# Altium project bms_mainboard-1_0.PrjPcb (part 6 of 7)

## Sheet eth_10base-t1s_phy.SchDoc
size B
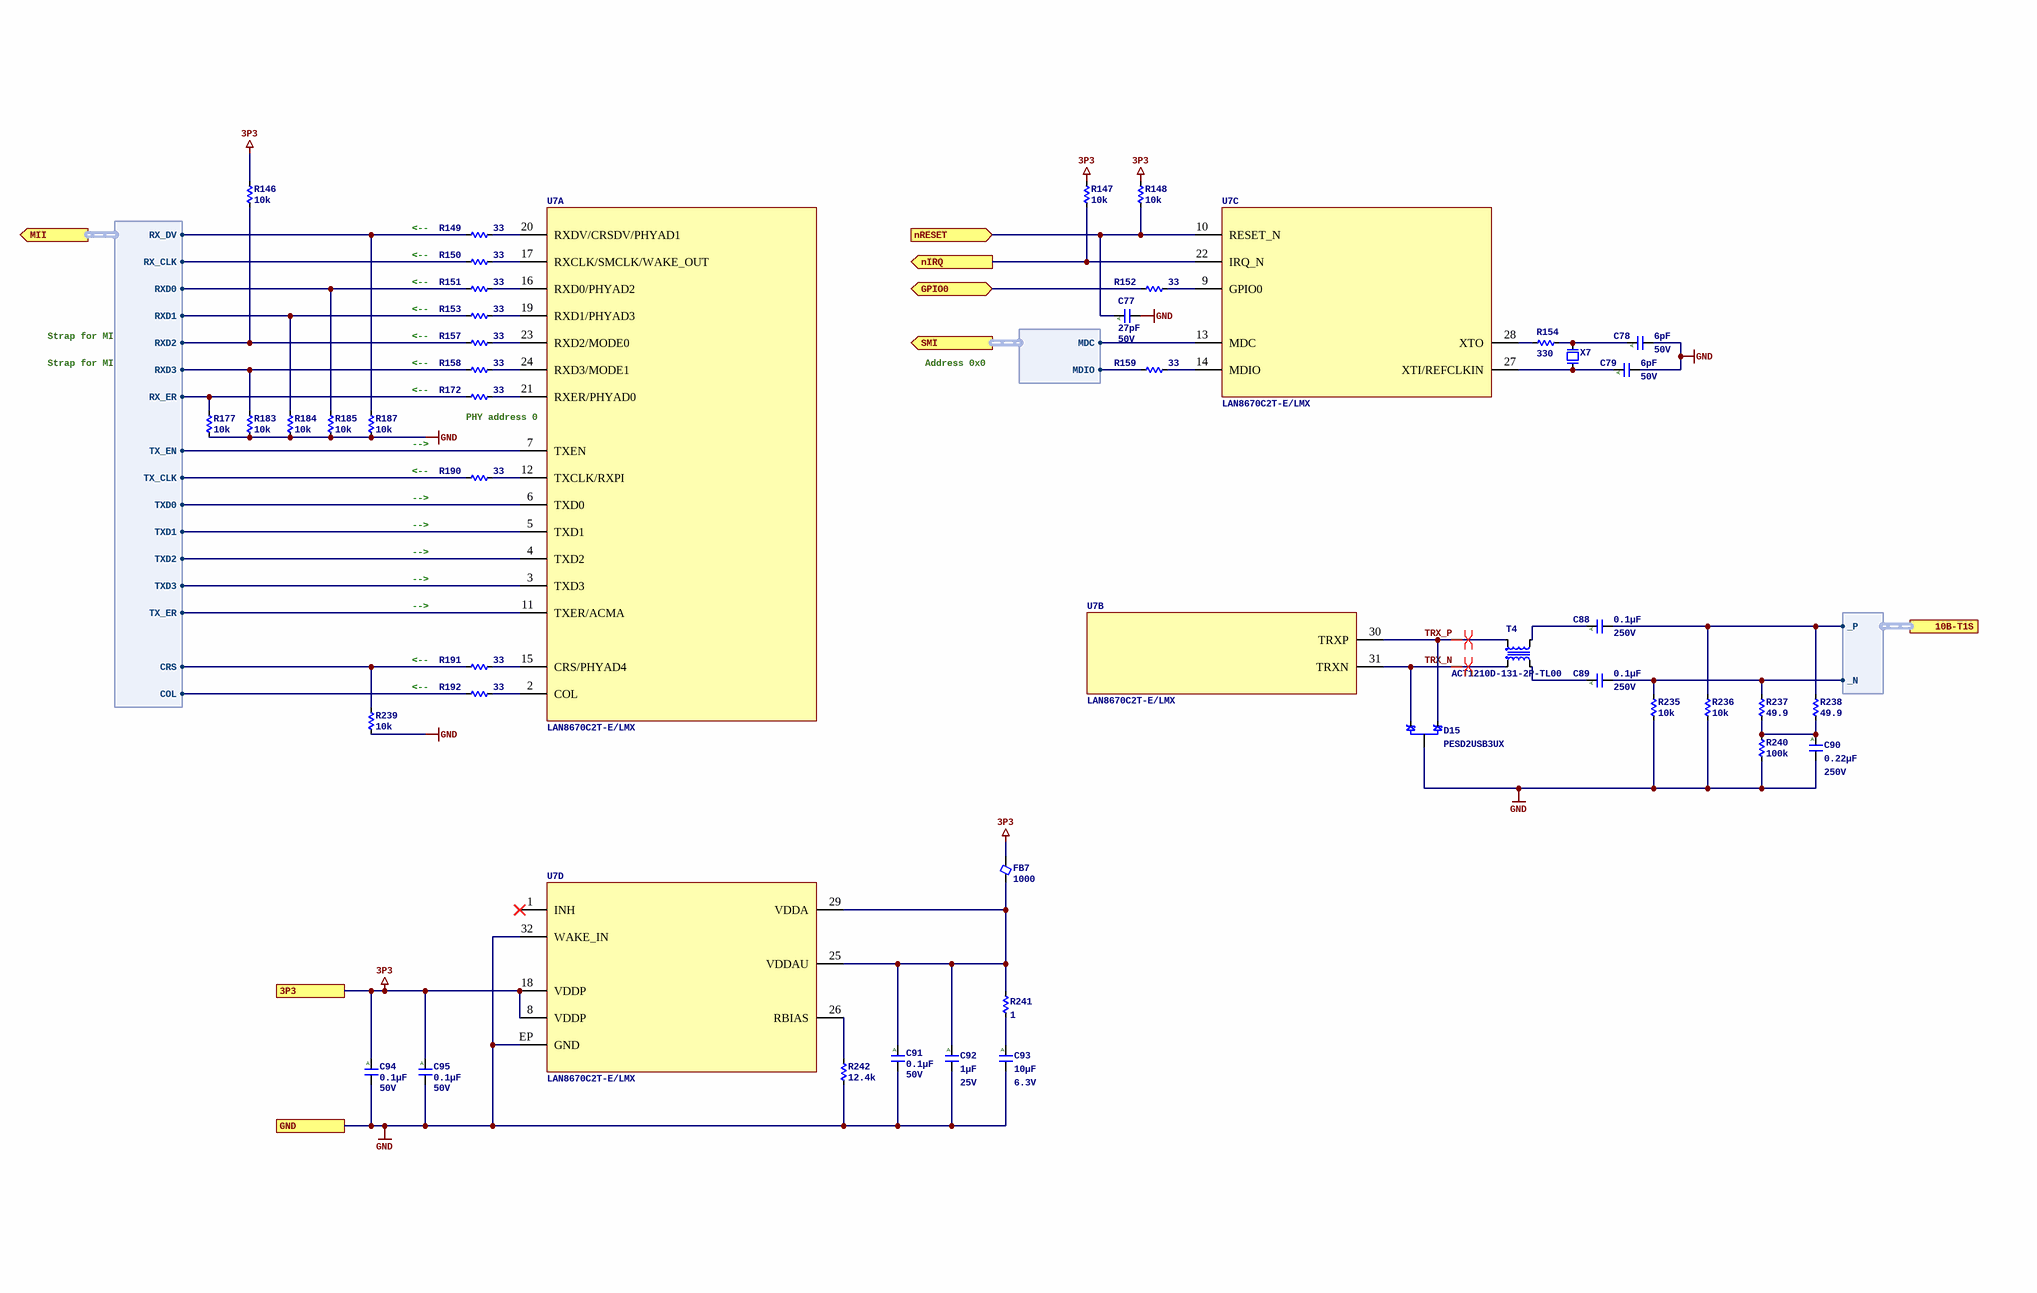
[diagram p27: eth_10base-t1s_phy.SchDoc]

### Parts
C77  Capacitance: 27pF  Voltage - Rated: 50V  [C0402_0.55MM]  (hidden comment: CGA2B2C0G1H270J050BA)
C78  Capacitance: 6pF  Voltage - Rated: 50V  [C0402_0.55MM]  (hidden comment: CGA2B2C0G1H060D050BA)
C79  Capacitance: 6pF  Voltage - Rated: 50V  [C0402_0.55MM]  (hidden comment: CGA2B2C0G1H060D050BA)
C88  Capacitance: 0.1µF  Voltage - Rated: 250V  [C1206_1.80MM]  (hidden comment: CGA5L3X7R2E104K160AA)
C89  Capacitance: 0.1µF  Voltage - Rated: 250V  [C1206_1.80MM]  (hidden comment: CGA5L3X7R2E104K160AA)
C90  Capacitance: 0.22µF  Voltage - Rated: 250V  [C1210_2.20MM]  (hidden comment: CGA6M3X7R2E224K200AA)
C91  Capacitance: 0.1µF  Voltage - Rated: 50V  [C0402_0.55MM]  (hidden comment: CGA2B3X7R1H104M050BB)
C92  Capacitance: 1µF  Voltage - Rated: 25V  [C0603_0.80MM]  (hidden comment: CGJ3E1X7R1E105K080AC)
C93  Capacitance: 10µF  Voltage - Rated: 6.3V  [C0805_1.45MM]  (hidden comment: CGA4J1X7R0J106M125AC)
C94  Capacitance: 0.1µF  Voltage - Rated: 50V  [C0402_0.55MM]  (hidden comment: CGA2B3X7R1H104M050BB)
C95  Capacitance: 0.1µF  Voltage - Rated: 50V  [C0402_0.55MM]  (hidden comment: CGA2B3X7R1H104M050BB)
D15  PESD2USB3UX  [3SOT23]
FB7  Impedance (Ohms @ 100MHz): 1000  [FB0805_1.05MM]  (hidden comment: MPZ2012S102AT000)
R146  Resistance: 10k  [R0402_0.40MM]  (hidden comment: ERJ-2RKF1002X)
R147  Resistance: 10k  [R0402_0.40MM]  (hidden comment: ERJ-2RKF1002X)
R148  Resistance: 10k  [R0402_0.40MM]  (hidden comment: ERJ-2RKF1002X)
R149  Resistance: 33  [R0402_0.40MM]  (hidden comment: ERJ-2RKF33R0X)
R150  Resistance: 33  [R0402_0.40MM]  (hidden comment: ERJ-2RKF33R0X)
R151  Resistance: 33  [R0402_0.40MM]  (hidden comment: ERJ-2RKF33R0X)
R152  Resistance: 33  [R0402_0.40MM]  (hidden comment: ERJ-2RKF33R0X)
R153  Resistance: 33  [R0402_0.40MM]  (hidden comment: ERJ-2RKF33R0X)
R154  Resistance: 330  [R0402_0.40MM]  (hidden comment: ERJ-PA2F3300X)
R157  Resistance: 33  [R0402_0.40MM]  (hidden comment: ERJ-2RKF33R0X)
R158  Resistance: 33  [R0402_0.40MM]  (hidden comment: ERJ-2RKF33R0X)
R159  Resistance: 33  [R0402_0.40MM]  (hidden comment: ERJ-2RKF33R0X)
R172  Resistance: 33  [R0402_0.40MM]  (hidden comment: ERJ-2RKF33R0X)
R177  Resistance: 10k  [R0402_0.40MM]  (hidden comment: ERJ-2RKF1002X)
R183  Resistance: 10k  [R0402_0.40MM]  (hidden comment: ERJ-2RKF1002X)
R184  Resistance: 10k  [R0402_0.40MM]  (hidden comment: ERJ-2RKF1002X)
R185  Resistance: 10k  [R0402_0.40MM]  (hidden comment: ERJ-2RKF1002X)
R187  Resistance: 10k  [R0402_0.40MM]  (hidden comment: ERJ-2RKF1002X)
R190  Resistance: 33  [R0402_0.40MM]  (hidden comment: ERJ-2RKF33R0X)
R191  Resistance: 33  [R0402_0.40MM]  (hidden comment: ERJ-2RKF33R0X)
R192  Resistance: 33  [R0402_0.40MM]  (hidden comment: ERJ-2RKF33R0X)
R235  Resistance: 10k  [R1206_0.70MM]  (hidden comment: ERJ-8ENF1002V)
R236  Resistance: 10k  [R1206_0.70MM]  (hidden comment: ERJ-8ENF1002V)
R237  Resistance: 49.9  [R1206_0.70MM]  (hidden comment: ERJ-8ENF49R9V)
R238  Resistance: 49.9  [R1206_0.70MM]  (hidden comment: ERJ-8ENF49R9V)
R239  Resistance: 10k  [R0402_0.40MM]  (hidden comment: ERJ-2RKF1002X)
R240  Resistance: 100k  [R1206_0.70MM]  (hidden comment: ERJ-8ENF1003V)
R241  Resistance: 1  [R0402_0.40MM]  (hidden comment: ERJ-2BQF1R0X)
R242  Resistance: 12.4k  [R0402_0.40MM]  (hidden comment: ERJ-2RKF1242X)
T4  ACT1210D-131-2P-TL00  [CHOKE_ACT1210D-131-2P-TL00]
U7  LAN8670C2T-E/LMX  [QFN50P500X500X90-32N]  (parts A,B,C,D of 4)
X7  XTAL_XRCGB25M000F3A00R0  [4_SMD_2.0X1.6MM]  (value not drawn)

### Ports
3P3, 10B-T1S (harness DIFF), GND, GPIO0 (bidir), MII (out, harness MII), nIRQ (out), nRESET (in), SMI (out, harness SMI)

### Harnesses
MII: RXD0, RXD1, TX_EN, TXD0, TXD1, RXD2, RXD3, TXD2, TXD3, TX_ER, TX_CLK, CRS, COL, RX_ER, RX_DV, RX_CLK
SMI: MDC, MDIO
DIFF: _N, _P

### Nets
3P3: C94.1 C95.1 FB7.2 R146.1 R147.1 R148.1 U7.8(VDDP) U7.18(VDDP) ; port 3P3
GND: C77.2 C78.2 C79.2 C90.2 C91.2 C92.2 C93.2 C94.2 C95.2 D15.3 R177.2 R183.2 R184.2 R185.2 R187.2 R235.2 R236.2 R239.2 R240.2 R242.2 U7.32(WAKE_IN) U7.EP(GND) ; port GND
10B-T1S_MDI._N: C89.2 R235.1 R237.1 ; port 10B-T1S._N
10B-T1S_MDI._P: C88.2 R236.1 R238.1 ; port 10B-T1S._P
MII_P7.COL: R192.2 ; port MII.COL
MII_P7.CRS: R191.2 R239.1 ; port MII.CRS
MII_P7.RX_CLK: R150.2 ; port MII.RX_CLK
MII_P7.RX_DV: R149.2 R187.1 ; port MII.RX_DV
MII_P7.RX_ER: R172.2 R177.1 ; port MII.RX_ER
MII_P7.RXD0: R151.2 R185.1 ; port MII.RXD0
MII_P7.RXD1: R153.2 R184.1 ; port MII.RXD1
MII_P7.RXD2: R146.2 R157.2 ; port MII.RXD2
MII_P7.RXD3: R158.2 R183.1 ; port MII.RXD3
MII_P7.TX_CLK: R190.2 ; port MII.TX_CLK
MII_P7.TX_EN: U7.7(TXEN) ; port MII.TX_EN
MII_P7.TX_ER: U7.11(TXER/ACMA) ; port MII.TX_ER
MII_P7.TXD0: U7.6(TXD0) ; port MII.TXD0
MII_P7.TXD1: U7.5(TXD1) ; port MII.TXD1
MII_P7.TXD2: U7.4(TXD2) ; port MII.TXD2
MII_P7.TXD3: U7.3(TXD3) ; port MII.TXD3
PHY_GPIO0: R152.2 ; port GPIO0
PHY_nIRQ: R147.2 U7.22(IRQ_N) ; port nIRQ
PHY_nRESET: C77.1 R148.2 U7.10(RESET_N) ; port nRESET
SMI.MDC: U7.13(MDC) ; port SMI.MDC
SMI.MDIO: R159.2 ; port SMI.MDIO
TRX_N: D15.1 T4.2 U7.31(TRXN)
TRX_P: D15.2 T4.1 U7.30(TRXP)
NetC78_1: C78.1 R154.2 X7.3
NetC79_1: C79.1 U7.27(XTI/REFCLKIN) X7.1
NetC88_1: C88.1 T4.4
NetC89_1: C89.1 T4.3
NetC90_1: C90.1 R237.2 R238.2 R240.1
NetC91_1: C91.1 C92.1 FB7.1 R241.2 U7.25(VDDAU) U7.29(VDDA)
NetC93_1: C93.1 R241.1
NetR149_1: R149.1 U7.20(RXDV/CRSDV/PHYAD1)
NetR150_1: R150.1 U7.17(RXCLK/SMCLK/WAKE_OUT)
NetR151_1: R151.1 U7.16(RXD0/PHYAD2)
NetR152_1: R152.1 U7.9(GPIO0)
NetR153_1: R153.1 U7.19(RXD1/PHYAD3)
NetR154_1: R154.1 U7.28(XTO)
NetR157_1: R157.1 U7.23(RXD2/MODE0)
NetR158_1: R158.1 U7.24(RXD3/MODE1)
NetR159_1: R159.1 U7.14(MDIO)
NetR172_1: R172.1 U7.21(RXER/PHYAD0)
NetR190_1: R190.1 U7.12(TXCLK/RXPI)
NetR191_1: R191.1 U7.15(CRS/PHYAD4)
NetR192_1: R192.1 U7.2(COL)
NetR242_1: R242.1 U7.26(RBIAS)

Not connected (* = marked no-connect by the designer): U7 1(INH)*

### Layout directives
differential pair; differential pair class DE_100: TRX_N, TRX_P

### Notes on the sheet
- <--
- Strap for MII
- Address 0x0
- (near R187) <--
- PHY address 0
- -->
- (near R187) -->
- (near R239) <--
- (in symbol CGA2B2C0G1H060D050BA) A
- (in symbol CGA2B2C0G1H270J050BA) A
- (in symbol CGA2B3X7R1H104M050BB) A
- (in symbol CGA4J1X7R0J106M125AC) A
- (in symbol CGA5L3X7R2E104K160AA) A
- (in symbol CGA6M3X7R2E224K200AA) A
- (in symbol CGJ3E1X7R1E105K080AC) A

### Library data of the parts
C77 = CGA2B2C0G1H270J050BA: CAP CER 27PF 50V C0G 0402; Manufacturer: TDK Corporation; Unit Price (USD): 0.1; Tolerance: ±5%; Temperature Coefficient: C0G, NP0; ComponentLink1URL: https://product.tdk.com/info/en/catalog/datasheets/mlcc_automotive_general_en.pdf?ref_disty=digikey; ComponentLink1Description: Series Datasheet; Series: CGA; Part Status: Active; Operating Temperature: -55°C ~ 125°C; Applications: AEC-Q200; Mounting Type: Surface Mount, MLCC; Package / Case: 0402 (1005 Metric); Size / Dimension: 0.039" L x 0.020" W (1.00mm x 0.50mm); Thickness (Max): 0.022" (0.55mm); Supplier 1: Digikey; Supplier Part Number 1: 445-5589-1-ND; Manufacturer Part Number: CGA2B2C0G1H270J050BA
C78 C79 = CGA2B2C0G1H060D050BA: CAP CER 6PF 50V C0G 0402; Manufacturer: TDK Corporation; Unit Price (USD): 0.1; Tolerance: ±0.5pF; Temperature Coefficient: C0G, NP0; ComponentLink1URL: https://product.tdk.com/info/en/catalog/datasheets/mlcc_automotive_general_en.pdf?ref_disty=digikey; ComponentLink1Description: Series Datasheet; Supplier 1: Digikey; Supplier Part Number 1: 445-5579-1-ND; Series: CGA; Part Status: Active; Operating Temperature: -55°C ~ 125°C; Applications: AEC-Q200; Mounting Type: Surface Mount, MLCC; Package / Case: 0402 (1005 Metric); Size / Dimension: 0.039" L x 0.020" W (1.00mm x 0.50mm); Thickness (Max): 0.022" (0.55mm); Manufacturer Part Number: CGA2B2C0G1H060D050BA
C88 C89 = CGA5L3X7R2E104K160AA: CAP CER 0.1UF 250V X7R 1206; Manufacturer: TDK Corporation; Unit Price (USD): 0.43; Tolerance: ±10%; ComponentLink1URL: https://product.tdk.com/info/en/catalog/datasheets/mlcc_automotive_midvoltage_en.pdf?ref_disty=digikey; ComponentLink1Description: Series Datasheet; Supplier 1: Digikey; Supplier Part Number 1: 445-5851-1-ND; Series: CGA; Part Status: Active; Temperature Coefficient: X7R; Operating Temperature: -55°C ~ 125°C; Applications: AEC-Q200; Mounting Type: Surface Mount, MLCC; Package / Case: 1206 (3216 Metric); Size / Dimension: 0.126" L x 0.063" W (3.20mm x 1.60mm); Thickness (Max): 0.071" (1.80mm); Manufacturer Part Number: CGA5L3X7R2E104K160AA
C90 = CGA6M3X7R2E224K200AA: CAP CER 0.22UF 250V X7R 1210; Manufacturer: TDK Corporation; Unit Price (USD): 0.77; Tolerance: ±10%; ComponentLink1URL: https://product.tdk.com/info/en/catalog/datasheets/mlcc_automotive_midvoltage_en.pdf?ref_disty=digikey; ComponentLink1Description: Series Datasheet; Supplier 1: Digikey; Supplier Part Number 1: 445-5869-1-ND; Series: CGA; Part Status: Active; Temperature Coefficient: X7R; Operating Temperature: -55°C ~ 125°C; Applications: AEC-Q200; Mounting Type: Surface Mount, MLCC; Package / Case: 1210 (3225 Metric); Size / Dimension: 0.126" L x 0.098" W (3.20mm x 2.50mm); Thickness (Max): 0.087" (2.20mm); Manufacturer Part Number: CGA6M3X7R2E224K200AA
C91 C94 C95 = CGA2B3X7R1H104M050BB: CAP CER 0.1UF 50V X7R 0402; Manufacturer: TDK Corporation; Unit Price (USD): 0.17; Tolerance: ±20%; ComponentLink1URL: https://product.tdk.com/info/en/catalog/datasheets/mlcc_automotive_general_en.pdf?ref_disty=digikey; ComponentLink1Description: Series Datasheet; Series: CGA; Part Status: Active; Temperature Coefficient: X7R; Operating Temperature: -55°C ~ 125°C; Applications: AEC-Q200; Mounting Type: Surface Mount, MLCC; Package / Case: 0402 (1005 Metric); Size / Dimension: 0.039" L x 0.020" W (1.00mm x 0.50mm); Thickness (Max): 0.022" (0.55mm); Supplier 1: Digikey; Supplier Part Number 1: 445-12271-1-ND; Manufacturer Part Number: CGA2B3X7R1H104M050BB
C92 = CGJ3E1X7R1E105K080AC: CAP CER 1UF 25V X7R 0603; Manufacturer: TDK Corporation; Unit Price (USD): 0.55; Tolerance: ±10%; ComponentLink1URL: https://product.tdk.com/info/en/catalog/datasheets/mlcc_highreliability_general_en.pdf?ref_disty=digikey; ComponentLink1Description: Series Datasheet; Series: CGJ; Part Status: Active; Temperature Coefficient: X7R; Operating Temperature: -55°C ~ 125°C; Applications: AEC-Q200; Mounting Type: Surface Mount, MLCC; Package / Case: 0603 (1608 Metric); Size / Dimension: 0.063" L x 0.031" W (1.60mm x 0.80mm); Thickness (Max): 0.031" (0.80mm); Supplier 1: Digikey; Supplier Part Number 1: 445-13311-1-ND; Manufacturer Part Number: CGJ3E1X7R1E105K080AC
C93 = CGA4J1X7R0J106M125AC: CAP CER 10UF 6.3V X7R 0805; Manufacturer: TDK Corporation; Unit Price (USD): 0.43; Tolerance: ±20%; ComponentLink1URL: https://product.tdk.com/info/en/catalog/datasheets/mlcc_automotive_general_en.pdf?ref_disty=digikey; ComponentLink1Description: Series Datasheet; Series: CGA; Part Status: Active; Temperature Coefficient: X7R; Operating Temperature: -55°C ~ 125°C; Applications: AEC-Q200; Mounting Type: Surface Mount, MLCC; Package / Case: 0805 (2012 Metric); Size / Dimension: 0.079" L x 0.049" W (2.00mm x 1.25mm); Thickness (Max): 0.057" (1.45mm); Supplier 1: Digikey; Supplier Part Number 1: 445-12776-1-ND; Manufacturer Part Number: CGA4J1X7R0J106M125AC
D15 = TVS_PESD2USB3UX-T: DIODE ESD USB SOT-23; Manufacturer: Nexperia USA Inc.; Supplier 1: Digikey; Supplier Part Number 1: 1727-PESD2USB3UX-CT-ND; Manufacturer Part Number: PESD2USB3UX; Supplier 2: LCSC; Supplier Part Number 2: C3708426; ComponentLink1Description: Datasheet; ComponentLink1URL: https://assets.nexperia.com/documents/data-sheet/PESD2USB3UX-T.pdf
FB7 = MPZ2012S102AT000: FERRITE BEAD 1 KOHM 0805 1LN; Manufacturer: TDK Corporation; Filter Type: Power Line; Current Rating (Max): 1.5A; DC Resistance (DCR) (Max): 150mOhm; ComponentLink1URL: https://product.tdk.com/info/en/catalog/datasheets/beads_commercial_power_mpz2012_en.pdf; ComponentLink1Description: Datasheet; Series: MPZ; Part Status: Active; Operating Temperature: -55°C ~ 125°C; Package / Case: 0805 (2012 Metric); Mounting Type: Surface Mount; Height (Max): 0.041" (1.05mm); Size / Dimension: 0.079" L x 0.049" W (2.00mm x 1.25mm); Supplier Part Number 1: 445-5223-1-ND; Supplier 1: Digikey; Manufacturer Part Number: MPZ2012S102AT000; Supplier 2: LCSC; Supplier Part Number 2: C76817
R146-R148 R177 R183-R185 R187 R239 = ERJ-2RKF1002X: as R264 on sheet digital_input_protection; ComponentLink1Description: Datasheet; ComponentLink1URL: https://industrial.panasonic.com/cdbs/www-data/pdf/RDA0000/AOA0000C304.pdf; Series: ERJ; Tolerance: ±1%; Composition: Thick Film; Features: Automotive AEC-Q200; Operating Temperature: -55°C ~ 155°C; Package / Case: 0402 (1005 Metric); Supplier Device Package: 0402; Size / Dimension: 0.039" L x 0.020" W (1.00mm x 0.50mm); Height - Seated (Max): 0.016" (0.40mm); Supplier 1: Digikey; Supplier Part Number 1: P10.0KLCT-ND; Manufacturer Part Number: ERJ-2RKF1002X
R149-R153 R157-R159 R172 R190-R192 = ERJ-2RKF33R0X: RES SMD 33 OHM 1% 1/10W 0402; Manufacturer: Panasonic Electronic Components; Unit Price (USD): 0.1; Power (Watts): 0.1W, 1/10W; Temperature Coefficient: ±100ppm/°C; ComponentLink1Description: Datasheet; ComponentLink1URL: https://industrial.panasonic.com/cdbs/www-data/pdf/RDA0000/AOA0000C304.pdf; Series: ERJ; Tolerance: ±1%; Composition: Thick Film; Features: Automotive AEC-Q200; Operating Temperature: -55°C ~ 155°C; Package / Case: 0402 (1005 Metric); Supplier Device Package: 0402; Size / Dimension: 0.039" L x 0.020" W (1.00mm x 0.50mm); Height - Seated (Max): 0.016" (0.40mm); Supplier 1: Digikey; Supplier Part Number 1: P33.0LCT-ND; Manufacturer Part Number: ERJ-2RKF33R0X
R154 = ERJ-PA2F3300X: RES SMD 330 OHM 1% 1/5W 0402; Manufacturer: Panasonic Electronic Components; Unit Price (USD): 0.21; Power (Watts): 0.2W, 1/5W; Temperature Coefficient: ±100ppm/°C; ComponentLink1Description: Datasheet; ComponentLink1URL: https://industrial.panasonic.com/cdbs/www-data/pdf/RDO0000/AOA0000C331.pdf; Series: ERJ; Tolerance: ±1%; Composition: Thick Film; Features: Automotive AEC-Q200, Pulse Withstanding; Operating Temperature: -55°C ~ 155°C; Package / Case: 0402 (1005 Metric); Supplier Device Package: 0402; Size / Dimension: 0.039" L x 0.020" W (1.00mm x 0.50mm); Height - Seated (Max): 0.016" (0.40mm); Supplier 1: Digikey; Supplier Part Number 1: P17221CT-ND; Manufacturer Part Number: ERJ-PA2F3300X
R235 R236 = ERJ-8ENF1002V: RES SMD 10K OHM 1% 1/4W 1206; Manufacturer: Panasonic Electronic Components; Unit Price (USD): 0.1; Power (Watts): 0.25W, 1/4W; Temperature Coefficient: ±100ppm/°C; ComponentLink1Description: Datasheet; ComponentLink1URL: https://industrial.panasonic.com/cdbs/www-data/pdf/RDA0000/AOA0000C304.pdf; Series: ERJ; Tolerance: ±1%; Composition: Thick Film; Features: Automotive AEC-Q200; Operating Temperature: -55°C ~ 155°C; Package / Case: 1206 (3216 Metric); Supplier Device Package: 1206; Size / Dimension: 0.126" L x 0.063" W (3.20mm x 1.60mm); Height - Seated (Max): 0.028" (0.70mm); Supplier 1: Digikey; Supplier Part Number 1: P10.0KFCT-ND; Manufacturer Part Number: ERJ-8ENF1002V
R237 R238 = ERJ-8ENF49R9V: RES SMD 49.9 OHM 1% 1/4W 1206; Manufacturer: Panasonic Electronic Components; Unit Price (USD): 0.1; Power (Watts): 0.25W, 1/4W; Temperature Coefficient: ±100ppm/°C; ComponentLink1Description: Datasheet; ComponentLink1URL: https://industrial.panasonic.com/cdbs/www-data/pdf/RDA0000/AOA0000C304.pdf; Series: ERJ; Tolerance: ±1%; Composition: Thick Film; Features: Automotive AEC-Q200; Operating Temperature: -55°C ~ 155°C; Package / Case: 1206 (3216 Metric); Supplier Device Package: 1206; Size / Dimension: 0.126" L x 0.063" W (3.20mm x 1.60mm); Height - Seated (Max): 0.028" (0.70mm); Supplier 1: Digikey; Supplier Part Number 1: P49.9FCT-ND; Manufacturer Part Number: ERJ-8ENF49R9V
R240 = ERJ-8ENF1003V: RES SMD 100K OHM 1% 1/4W 1206; Manufacturer: Panasonic Electronic Components; Unit Price (USD): 0.1; Power (Watts): 0.25W, 1/4W; Temperature Coefficient: ±100ppm/°C; ComponentLink1Description: Datasheet; ComponentLink1URL: https://industrial.panasonic.com/cdbs/www-data/pdf/RDA0000/AOA0000C304.pdf; Series: ERJ; Tolerance: ±1%; Composition: Thick Film; Features: Automotive AEC-Q200; Operating Temperature: -55°C ~ 155°C; Package / Case: 1206 (3216 Metric); Supplier Device Package: 1206; Size / Dimension: 0.126" L x 0.063" W (3.20mm x 1.60mm); Height - Seated (Max): 0.028" (0.70mm); Supplier 1: Digikey; Supplier Part Number 1: P100KFCT-ND; Manufacturer Part Number: ERJ-8ENF1003V
R241 = ERJ-2BQF1R0X: RES SMD 1 OHM 1% 1/6W 0402; Manufacturer: Panasonic Electronic Components; Unit Price (USD): 0.41; Power (Watts): 0.167W, 1/6W; Temperature Coefficient: ±250ppm/°C; ComponentLink1Description: Datasheet; ComponentLink1URL: https://industrial.panasonic.com/cdbs/www-data/pdf/RDN0000/AOA0000C313.pdf; Series: ERJ; Tolerance: ±1%; Composition: Thick Film; Features: Automotive AEC-Q200, Current Sense; Operating Temperature: -55°C ~ 125°C; Package / Case: 0402 (1005 Metric); Supplier Device Package: 0402; Size / Dimension: 0.039" L x 0.020" W (1.00mm x 0.50mm); Height - Seated (Max): 0.016" (0.40mm); Supplier 1: Digikey; Supplier Part Number 1: P17252CT-ND; Manufacturer Part Number: ERJ-2BQF1R0X
R242 = ERJ-2RKF1242X: RES SMD 12.4K OHM 1% 1/10W 0402; Manufacturer: Panasonic Electronic Components; Unit Price (USD): 0.1; Power (Watts): 0.1W, 1/10W; Temperature Coefficient: ±100ppm/°C; ComponentLink1Description: Datasheet; ComponentLink1URL: https://industrial.panasonic.com/cdbs/www-data/pdf/RDA0000/AOA0000C304.pdf; Series: ERJ; Tolerance: ±1%; Composition: Thick Film; Features: Automotive AEC-Q200; Operating Temperature: -55°C ~ 155°C; Package / Case: 0402 (1005 Metric); Supplier Device Package: 0402; Size / Dimension: 0.039" L x 0.020" W (1.00mm x 0.50mm); Height - Seated (Max): 0.016" (0.40mm); Supplier 1: Digikey; Supplier Part Number 1: P12.4KLCT-ND; Manufacturer Part Number: ERJ-2RKF1242X
T4 = CHOKE_ACT1210D-131-2P-TL00: 130 µH @ 100 kHz 2 Line Common Mode Choke Surface Mount 6.7 kOhms @ 10 MHz 115mA DCR 3.5Ohm; Manufacturer: TDK Corporation; Supplier 1: Digikey; ComponentLink1URL: https://product.tdk.com/system/files/dam/doc/product/emc/emc/cmf_cmc/catalog/cmf_automotive_signal_act1210d_en.pdf; ComponentLink1Description: Datasheet; Supplier Part Number 1: 445-ACT1210D-131-2P-TL00CT-ND; Manufacturer Part Number: ACT1210D-131-2P-TL00; Supplier 2: LCSC; Supplier Part Number 2: C5547342
U7 = ETH_PHY_LAN8670C2T-E/LMX: 10BASE-T1S PHY WITH MII/RMII "1/1 Transceiver Full, Half Ethernet 32-VQFN (5x5)"; Manufacturer: Microchip; Supplier 1: DigiKey; Supplier Part Number 1: 150-LAN8670C2T-E/LMXCT-ND; Manufacturer Part Number: LAN8670C2T-E/LMX; ComponentLink1Description: Datasheet; ComponentLink1URL: https://ww1.microchip.com/downloads/aemDocuments/documents/AIS/ProductDocuments/DataSheets/LAN8670-1-2-Data-Sheet-60001573.pdf; Supplier 2: LCSC; Supplier Part Number 2: C20901523
X7 = XTAL_XRCGB25M000F3A00R0: as X4 on sheet eth_ksz8567r_switch; Supplier 1: Digikey; Supplier Part Number 1: 490-12146-2-ND; Manufacturer Part Number: XRCGB25M000F3A00R0; Supplier 2: LCSC; Supplier Part Number 2: C467842; ComponentLink1Description: Datasheet; ComponentLink1URL: https://www.murata.com/products/productdata/8801076543518/SPEC-XRCGB25M000F3A00R0.pdf

## Sheet isolator_si8662.SchDoc
size A
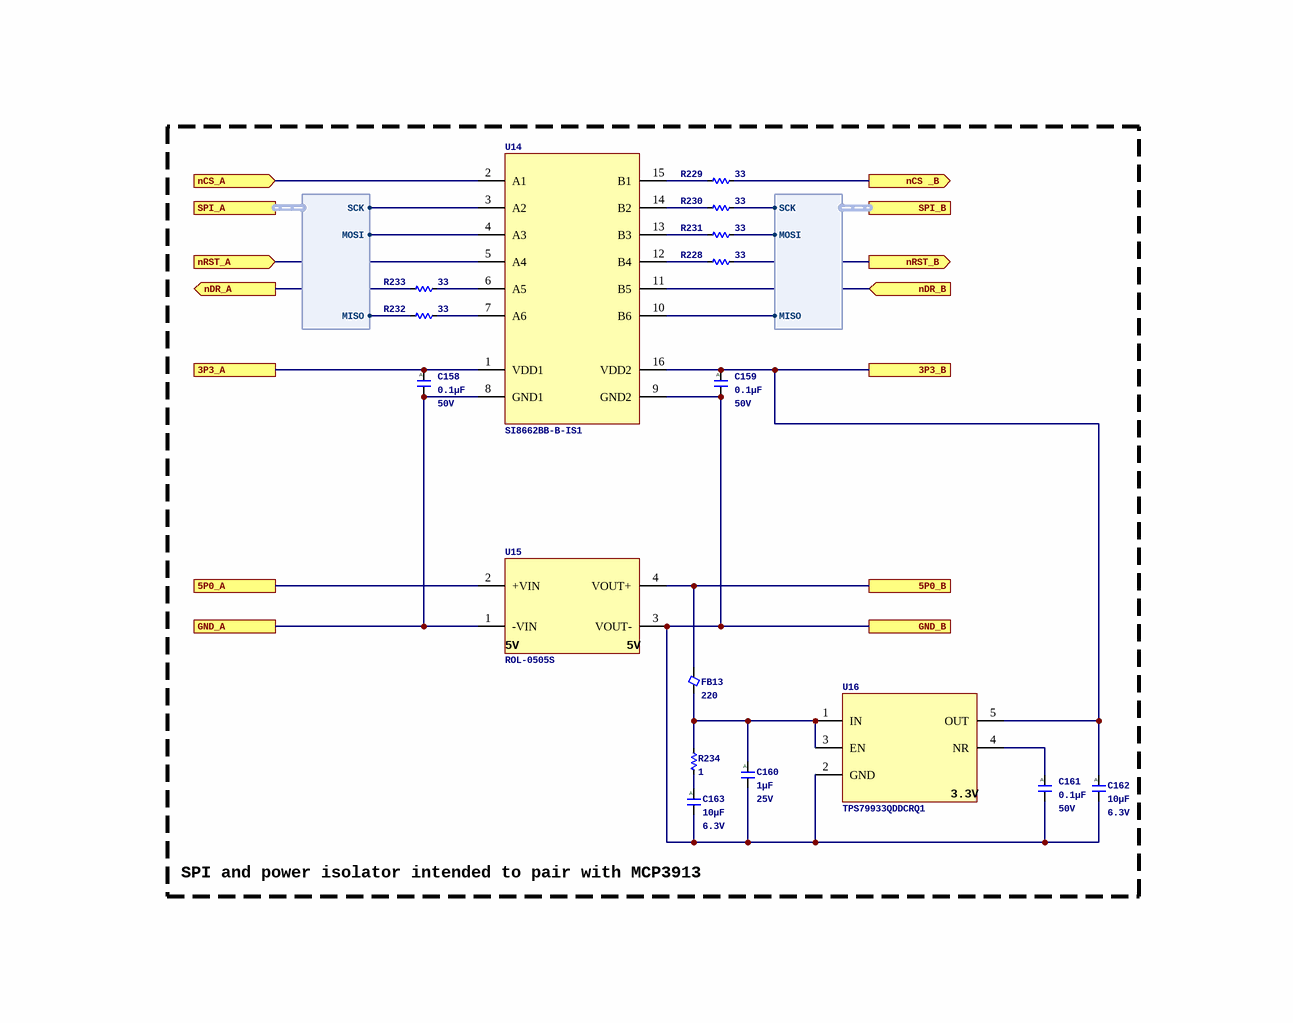
[diagram p28: isolator_si8662.SchDoc]

### Parts
C158  Capacitance: 0.1µF  Voltage - Rated: 50V  [C0402_0.55MM]  (hidden comment: CGA2B3X7R1H104M050BB)
C159  Capacitance: 0.1µF  Voltage - Rated: 50V  [C0402_0.55MM]  (hidden comment: CGA2B3X7R1H104M050BB)
C160  Capacitance: 1µF  Voltage - Rated: 25V  [C0603_0.80MM]  (hidden comment: CGJ3E1X7R1E105K080AC)
C161  Capacitance: 0.1µF  Voltage - Rated: 50V  [C0402_0.55MM]  (hidden comment: CGA2B3X7R1H104M050BB)
C162  Capacitance: 10µF  Voltage - Rated: 6.3V  [C0805_1.45MM]  (hidden comment: CGA4J1X7R0J106M125AC)
C163  Capacitance: 10µF  Voltage - Rated: 6.3V  [C0805_1.45MM]  (hidden comment: CGA4J1X7R0J106M125AC)
FB13  Impedance (Ohms @ 100MHz): 220  [FB0402_0.55MM]  (hidden comment: MPZ1005S221ET000)
R228  Resistance: 33  [R0402_0.40MM]  (hidden comment: ERJ-2RKF33R0X)
R229  Resistance: 33  [R0402_0.40MM]  (hidden comment: ERJ-2RKF33R0X)
R230  Resistance: 33  [R0402_0.40MM]  (hidden comment: ERJ-2RKF33R0X)
R231  Resistance: 33  [R0402_0.40MM]  (hidden comment: ERJ-2RKF33R0X)
R232  Resistance: 33  [R0402_0.40MM]  (hidden comment: ERJ-2RKF33R0X)
R233  Resistance: 33  [R0402_0.40MM]  (hidden comment: ERJ-2RKF33R0X)
R234  Resistance: 1  [R0402_0.40MM]  (hidden comment: ERJ-2BQF1R0X)
U14  SI8662BB-B-IS1  [16SOIC150]
U15  ROL-0505S  [4SIP]
U16  TPS79933QDDCRQ1  [5SOT23]

### Blocks framed on the sheet
SPI and power isolator intended to pair with MCP3913: C158-C163 FB13 R228-R234 U14-U16

### Ports
3P3_A, 3P3_B, 5P0_A, 5P0_B, GND_A, GND_B, nCS _B (out), nCS_A (in), nDR_A (out), nDR_B (in), nRST_A (in), nRST_B (out), SPI_A (harness SPI), SPI_B (harness SPI)

### Harnesses
SPI: MISO, MOSI, SCK

### Nets
3P3: C158.1 U14.1(VDD1) ; port 3P3_A
3P3_B: C159.1 C162.1 U14.16(VDD2) U16.5(OUT) ; port 3P3_B
5P0: U15.2(+VIN) ; port 5P0_A
5P0_B: FB13.2 U15.4(VOUT+) ; port 5P0_B
GND: C158.2 U14.8(GND1) U15.1(-VIN) ; port GND_A
HV_N: C159.2 C160.2 C161.2 C162.2 C163.2 U14.9(GND2) U15.3(VOUT-) U16.2(GND) ; port GND_B
MCP3913_nDR: R233.2 ; port nDR_A
MCP3913_nDR_ISO: U14.11(B5) ; port nDR_B
MCP3913_nRST: U14.5(A4) ; port nRST_A
MCP3913_nRST_ISO: R228.1 ; port nRST_B
SPI4.MISO: R232.2 ; port SPI_A.MISO
SPI4.MOSI: U14.4(A3) ; port SPI_A.MOSI
SPI4.SCK: U14.3(A2) ; port SPI_A.SCK
SPI4_ISO.MISO: U14.10(B6) ; port SPI_B.MISO
SPI4_ISO.MOSI: R231.1 ; port SPI_B.MOSI
SPI4_ISO.SCK: R230.1 ; port SPI_B.SCK
SPI4_nSS: U14.2(A1) ; port nCS_A
SPI4_nSS_ISO: R229.1 ; port nCS _B
NetC160_1: C160.1 FB13.1 R234.2 U16.1(IN) U16.3(EN)
NetC161_1: C161.1 U16.4(NR)
NetC163_1: C163.1 R234.1
NetR228_2: R228.2 U14.12(B4)
NetR229_2: R229.2 U14.15(B1)
NetR230_2: R230.2 U14.14(B2)
NetR231_2: R231.2 U14.13(B3)
NetR232_1: R232.1 U14.7(A6)
NetR233_1: R233.1 U14.6(A5)

### Notes on the sheet
- (in symbol CGA2B3X7R1H104M050BB) A
- (in symbol CGA4J1X7R0J106M125AC) A
- (in symbol CGJ3E1X7R1E105K080AC) A
- (in symbol CONV_DCDC_5V_0.5W_ROL-0505S) 5V
- (in symbol LDO_TPS79933QDDCRQ1) 3.3V
- (in symbol ROL-0505S) 5V
- (in symbol TPS79933QDDCRQ1) 3.3V

### Library data of the parts
C158 C159 C161 = CGA2B3X7R1H104M050BB: as C91 on sheet eth_10base-t1s_phy; ComponentLink1URL: https://product.tdk.com/info/en/catalog/datasheets/mlcc_automotive_general_en.pdf?ref_disty=digikey; ComponentLink1Description: Series Datasheet; Series: CGA; Part Status: Active; Temperature Coefficient: X7R; Operating Temperature: -55°C ~ 125°C; Applications: AEC-Q200; Mounting Type: Surface Mount, MLCC; Package / Case: 0402 (1005 Metric); Size / Dimension: 0.039" L x 0.020" W (1.00mm x 0.50mm); Thickness (Max): 0.022" (0.55mm); Supplier 1: Digikey; Supplier Part Number 1: 445-12271-1-ND; Manufacturer Part Number: CGA2B3X7R1H104M050BB
C160 = CGJ3E1X7R1E105K080AC: as C92 on sheet eth_10base-t1s_phy; ComponentLink1URL: https://product.tdk.com/info/en/catalog/datasheets/mlcc_highreliability_general_en.pdf?ref_disty=digikey; ComponentLink1Description: Series Datasheet; Series: CGJ; Part Status: Active; Temperature Coefficient: X7R; Operating Temperature: -55°C ~ 125°C; Applications: AEC-Q200; Mounting Type: Surface Mount, MLCC; Package / Case: 0603 (1608 Metric); Size / Dimension: 0.063" L x 0.031" W (1.60mm x 0.80mm); Thickness (Max): 0.031" (0.80mm); Supplier 1: Digikey; Supplier Part Number 1: 445-13311-1-ND; Manufacturer Part Number: CGJ3E1X7R1E105K080AC
C162 C163 = CGA4J1X7R0J106M125AC: as C93 on sheet eth_10base-t1s_phy; ComponentLink1URL: https://product.tdk.com/info/en/catalog/datasheets/mlcc_automotive_general_en.pdf?ref_disty=digikey; ComponentLink1Description: Series Datasheet; Series: CGA; Part Status: Active; Temperature Coefficient: X7R; Operating Temperature: -55°C ~ 125°C; Applications: AEC-Q200; Mounting Type: Surface Mount, MLCC; Package / Case: 0805 (2012 Metric); Size / Dimension: 0.079" L x 0.049" W (2.00mm x 1.25mm); Thickness (Max): 0.057" (1.45mm); Supplier 1: Digikey; Supplier Part Number 1: 445-12776-1-ND; Manufacturer Part Number: CGA4J1X7R0J106M125AC
FB13 = MPZ1005S221ET000: FERRITE BEAD 220 OHM 0402 1LN; Manufacturer: TDK Corporation; Filter Type: Power Line; Current Rating (Max): 900mA; DC Resistance (DCR) (Max): 220mOhm; ComponentLink1URL: https://product.tdk.com/info/en/catalog/datasheets/beads_commercial_power_mpz1005-e_en.pdf; ComponentLink1Description: Datasheet; Series: MPZ-E; Part Status: Active; Operating Temperature: -55°C ~ 125°C; Package / Case: 0402 (1005 Metric); Mounting Type: Surface Mount; Height (Max): 0.022" (0.55mm); Size / Dimension: 0.039" L x 0.020" W (1.00mm x 0.50mm); Supplier Part Number 1: 445-9329-1-ND; Supplier 1: Digikey; Manufacturer Part Number: MPZ1005S221ET000; Supplier 2: LCSC; Supplier Part Number 2: C165811
R228-R233 = ERJ-2RKF33R0X: as R149 on sheet eth_10base-t1s_phy; ComponentLink1Description: Datasheet; ComponentLink1URL: https://industrial.panasonic.com/cdbs/www-data/pdf/RDA0000/AOA0000C304.pdf; Series: ERJ; Tolerance: ±1%; Composition: Thick Film; Features: Automotive AEC-Q200; Operating Temperature: -55°C ~ 155°C; Package / Case: 0402 (1005 Metric); Supplier Device Package: 0402; Size / Dimension: 0.039" L x 0.020" W (1.00mm x 0.50mm); Height - Seated (Max): 0.016" (0.40mm); Supplier 1: Digikey; Supplier Part Number 1: P33.0LCT-ND; Manufacturer Part Number: ERJ-2RKF33R0X
R234 = ERJ-2BQF1R0X: as R241 on sheet eth_10base-t1s_phy; ComponentLink1Description: Datasheet; ComponentLink1URL: https://industrial.panasonic.com/cdbs/www-data/pdf/RDN0000/AOA0000C313.pdf; Series: ERJ; Tolerance: ±1%; Composition: Thick Film; Features: Automotive AEC-Q200, Current Sense; Operating Temperature: -55°C ~ 125°C; Package / Case: 0402 (1005 Metric); Supplier Device Package: 0402; Size / Dimension: 0.039" L x 0.020" W (1.00mm x 0.50mm); Height - Seated (Max): 0.016" (0.40mm); Supplier 1: Digikey; Supplier Part Number 1: P17252CT-ND; Manufacturer Part Number: ERJ-2BQF1R0X
U14 = ISO_SI8662BB-B-IS1: 6-ch 2.5kV Isolator, 150M, 4/2, NB SOIC16, lead free; Manufacturer: Skyworks Solutions; Supplier 1: Digikey; Supplier Part Number 1: SI8662BB-B-IS1-ND; Manufacturer Part Number: SI8662BB-B-IS1; Supplier 2: LCSC; Supplier Part Number 2: C430287; ComponentLink1Description: Datasheet; ComponentLink1URL: https://www.skyworksinc.com/-/media/Skyworks/SL/documents/public/data-sheets/Si866x.pdf
U15 = CONV_DCDC_5V_0.5W_ROL-0505S: 5V to 5V isolated power supply module; Manufacturer: Recom; Parameter 1: LCSC; Parameter 2: C22372006; Supplier 1: Digikey; Supplier Part Number 1: 945-1949-5-ND; Manufacturer Part Number: ROL-0505S; ComponentLink1Description: Datasheet; ComponentLink1URL: https://recom-power.com/pdf/Econoline/ROL.pdf
U16 = LDO_TPS79933QDDCRQ1: Fixed Positive LDO Regulator, 3.3V, 0.16V Dropout, BICMOS, PDSO5; Manufacturer: Texas Instruments; Supplier 1: Digikey; Supplier Part Number 1: 296-24852-1-ND; Manufacturer Part Number: TPS79933QDDCRQ1; RoHS Compliant: Yes; ComponentLink1Description: Datasheet; ComponentLink1URL: https://www.ti.com/lit/ds/symlink/tps799-q1.pdf; Supplier 2: LCSC; Supplier Part Number 2: C2865613

## Sheet pmic_tps79933.SchDoc
size A
Used 2 times, as channels pmic_tps79933, pmic_tps79933. Parts and nets are listed once, with the designators drawn on the sheet.
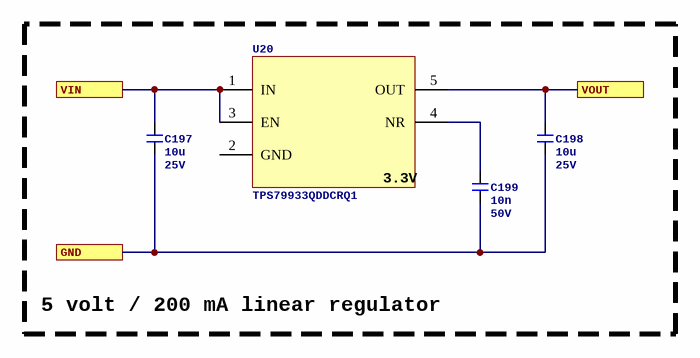
[diagram p29: pmic_tps79933.SchDoc]

### Parts
C197  Capacitance: 10u  Voltage Rating: 25V  [C0805]  (hidden comment: CL21B106KAYQNNE)
C198  Capacitance: 10u  Voltage Rating: 25V  [C0805]  (hidden comment: CL21B106KAYQNNE)
C199  Capacitance: 10n  Voltage Rating: 50V  [C0402]  (hidden comment: CL05B103KB5NNNC)
U20  TPS79933QDDCRQ1  [5SOT23]

### Blocks framed on the sheet
5 volt / 200 mA linear regulator: C197-C199 U20

### Ports
GND, VIN, VOUT

### Nets
GND: C197.2 C198.2 C199.2 ; port GND
VIN: C197.1 U20.1(IN) U20.3(EN) ; port VIN
VOUT: C198.1 U20.5(OUT) ; port VOUT
NetC199_1: C199.1 U20.4(NR)

Not connected (* = marked no-connect by the designer): U20 2(GND)

### Channels
pmic_tps79933: designators end in A; ports GND=GND VIN=VBUS VOUT=3P3_USB
pmic_tps79933: designators end in B; ports GND=GND VIN=5P0 VOUT=3P3_GNSS

### Notes on the sheet
- (in symbol LDO_TPS79933QDDCRQ1) 3.3V
- (in symbol TPS79933QDDCRQ1) 3.3V

### Library data of the parts
C197 C198 = CL21B106KAYQNNE: as C111 on sheet eth_ksz8567r_switch; ComponentLink1URL: https://datasheet.lcsc.com/lcsc/2206222030_Samsung-Electro-Mechanics-CL21B106KAYQNNE_C3039694.pdf; ComponentLink1Description: Datasheet; Manufacturer Part Number: CL21B106KAYQNNE; Package: 0805; Supplier 2: LCSC; Supplier Part Number 2: C3039694
C199 = CL05B103KB5NNNC: as C48 on sheet eth_100base-tx_magnetics; ComponentLink1URL: https://wmsc.lcsc.com/wmsc/upload/file/pdf/v2/lcsc/2304140030_Samsung-Electro-Mechanics-CL05B103KB5NNNC_C15195.pdf; ComponentLink1Description: Datasheet; Manufacturer Part Number: CL05B103KB5NNNC; Package: 0402; Supplier 2: LCSC; Supplier Part Number 2: C15195
U20 = LDO_TPS79933QDDCRQ1: as U16 on sheet isolator_si8662; Supplier 1: Digikey; Supplier Part Number 1: 296-24852-1-ND; Manufacturer Part Number: TPS79933QDDCRQ1; RoHS Compliant: Yes; ComponentLink1Description: Datasheet; ComponentLink1URL: https://www.ti.com/lit/ds/symlink/tps799-q1.pdf; Supplier 2: LCSC; Supplier Part Number 2: C2865613

## Sheet imu_ism330.SchDoc
size A
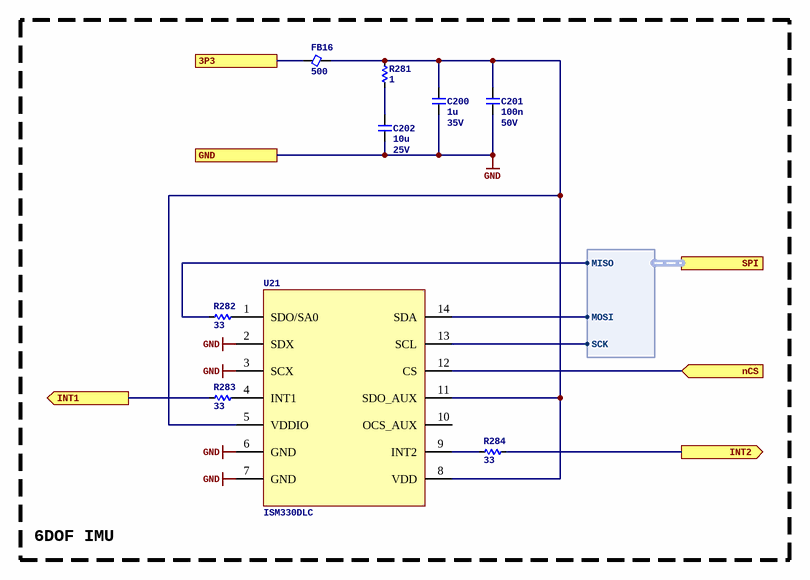
[diagram p30: imu_ism330.SchDoc]

### Parts
C200  Capacitance: 1u  Voltage Rating: 35V  [C0603]  (hidden comment: GMK107AB7105KAHT)
C201  Capacitance: 100n  Voltage Rating: 50V  [C0402]  (hidden comment: CL05B104KB54PNC)
C202  Capacitance: 10u  Voltage Rating: 25V  [C0805]  (hidden comment: CL21B106KAYQNNE)
FB16  Current Rating (mA): 500  [FB0402]  (hidden comment: BLM15AX601SN1D)
R281  value 1  [R0402]  (hidden comment: CRCW04021R00FKED)
R282  value 33  [R0402]  (hidden comment: 0402WGF330JTCE)
R283  value 33  [R0402]  (hidden comment: 0402WGF330JTCE)
R284  value 33  [R0402]  (hidden comment: 0402WGF330JTCE)
U21  ISM330DLC  [ST_LGA-14L]

### Blocks framed on the sheet
6DOF IMU: C200-C202 FB16 R281-R284 U21

### Ports
3P3, GND, INT1 (out), INT2 (out), nCS (in), SPI (harness SPI)

### Harnesses
SPI: MISO, MOSI, SCK

### Nets
3P3: FB16.1 ; port 3P3
GND: C200.2 C201.2 C202.2 U21.2(SDX) U21.3(SCX) U21.6(GND) U21.7(GND) ; port GND
IMU_INT1: R283.1 ; port INT1
IMU_INT2: R284.2 ; port INT2
SPI6.MISO: R282.1 ; port SPI.MISO
SPI6.MOSI: U21.14(SDA) ; port SPI.MOSI
SPI6.SCK: U21.13(SCL) ; port SPI.SCK
SPI6_nSS: U21.12(CS) ; port nCS
NetC200_1: C200.1 C201.1 FB16.2 R281.2 U21.5(VDDIO) U21.8(VDD) U21.11(SDO_AUX)
NetC202_1: C202.1 R281.1
NetR282_2: R282.2 U21.1(SDO/SA0)
NetR283_2: R283.2 U21.4(INT1)
NetR284_1: R284.1 U21.9(INT2)

Not connected (* = marked no-connect by the designer): U21 10(OCS_AUX)

### Library data of the parts
C200 = GMK107AB7105KAHT: Manufacturer: Taiyo Yuden; Dielectric: X7R; ComponentLink1URL: https://datasheet.lcsc.com/lcsc/2304140030_Taiyo-Yuden-GMK107AB7105KAHT_C841050.pdf; ComponentLink1Description: Datasheet; Manufacturer Part Number: GMK107AB7105KAHT; Package: 0603; Supplier 2: LCSC; Supplier Part Number 2: C841050
C201 = CL05B104KB54PNC: as C101-C103 on sheet can_tcan1462v; ComponentLink1URL: https://wmsc.lcsc.com/wmsc/upload/file/pdf/v2/lcsc/2304140030_Samsung-Electro-Mechanics-CL05B104KB54PNC_C307331.pdf; ComponentLink1Description: Datasheet; Manufacturer Part Number: CL05B104KB54PNC; Package: 0402; Supplier 2: LCSC; Supplier Part Number 2: C307331
C202 = CL21B106KAYQNNE: as C111 on sheet eth_ksz8567r_switch; ComponentLink1URL: https://datasheet.lcsc.com/lcsc/2206222030_Samsung-Electro-Mechanics-CL21B106KAYQNNE_C3039694.pdf; ComponentLink1Description: Datasheet; Manufacturer Part Number: CL21B106KAYQNNE; Package: 0805; Supplier 2: LCSC; Supplier Part Number 2: C3039694
FB16 = BLM15AX601SN1D: as FB12 on sheet analog_sensor_input; ComponentLink1URL: https://wmsc.lcsc.com/wmsc/upload/file/pdf/v2/lcsc/2304140030_Murata-Electronics-BLM15AX601SN1D_C76886.pdf; ComponentLink1Description: Datasheet; Manufacturer Part Number: BLM15AX601SN1D; Package: 0402; Supplier 2: LCSC; Supplier Part Number 2: C76886
R281 = CRCW04021R00FKED: as R166 on sheet eth_ksz8567r_switch; ComponentLink1Description: Datasheet; ComponentLink1URL: https://wmsc.lcsc.com/wmsc/upload/file/pdf/v2/lcsc/2211030200_Vishay-Intertech-CRCW04021R00FKED_C482087.pdf; Manufacturer Part Number: CRCW04021R00FKED; Package: 0402; Supplier 2: LCSC; Supplier Part Number 2: C482087
R282-R284 = 0402WGF330JTCE: as R161 on sheet can_tcan1462v; ComponentLink1Description: Datasheet; ComponentLink1URL: https://wmsc.lcsc.com/wmsc/upload/file/pdf/v2/lcsc/2205311900_UNI-ROYAL-Uniroyal-Elec-0402WGF330JTCE_C25105.pdf; Manufacturer Part Number: 0402WGF330JTCE; Package: 0402; Supplier 2: LCSC; Supplier Part Number 2: C25105
U21 = IMU_ISM330DLC: ST ACCELEROMETER/GYROSCOPE 3D 14LGA LOW POWER; Manufacturer: ST Microelectronics; Supplier 1: Digi-Key; Supplier Part Number 1: 497-17583-6-ND; ComponentLink1Description: Datasheet; ComponentLink1URL: https://www.st.com/resource/en/datasheet/ism330dlc.pdf; Manufacturer Part Number: ISM330DLC; Supplier 2: LCSC; Supplier Part Number 2: C2943126

## Sheet dht_bme280.SchDoc
size A
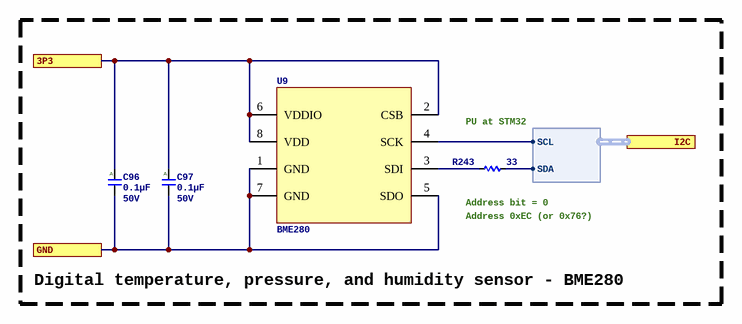
[diagram p31: dht_bme280.SchDoc]

### Parts
C96  Capacitance: 0.1µF  Voltage - Rated: 50V  [C0402_0.55MM]  (hidden comment: CGA2B3X7R1H104M050BB)
C97  Capacitance: 0.1µF  Voltage - Rated: 50V  [C0402_0.55MM]  (hidden comment: CGA2B3X7R1H104M050BB)
R243  Resistance: 33  [R0402_0.40MM]  (hidden comment: ERJ-2RKF33R0X)
U9  BME280  [BOSCH_BME280]

### Ports
3P3, GND, I2C (harness I2C)

### Harnesses
I2C: SCL, SDA

### Nets
3P3: C96.1 C97.1 U9.2(CSB) U9.6(VDDIO) U9.8(VDD) ; port 3P3
GND: C96.2 C97.2 U9.1(GND) U9.5(SDO) U9.7(GND) ; port GND
I2C1.SCL: U9.4(SCK) ; port I2C.SCL
I2C1.SDA: R243.1 ; port I2C.SDA
NetR243_2: R243.2 U9.3(SDI)

### Notes on the sheet
- PU at STM32
- Address 0xEC (or 0x76?)
- (near R243) Address bit = 0
- Digital temperature, pressure, and humidity sensor - BME280
- (in symbol CGA2B3X7R1H104M050BB) A

### Library data of the parts
C96 C97 = CGA2B3X7R1H104M050BB: as C91 on sheet eth_10base-t1s_phy; ComponentLink1URL: https://product.tdk.com/info/en/catalog/datasheets/mlcc_automotive_general_en.pdf?ref_disty=digikey; ComponentLink1Description: Series Datasheet; Series: CGA; Part Status: Active; Temperature Coefficient: X7R; Operating Temperature: -55°C ~ 125°C; Applications: AEC-Q200; Mounting Type: Surface Mount, MLCC; Package / Case: 0402 (1005 Metric); Size / Dimension: 0.039" L x 0.020" W (1.00mm x 0.50mm); Thickness (Max): 0.022" (0.55mm); Supplier 1: Digikey; Supplier Part Number 1: 445-12271-1-ND; Manufacturer Part Number: CGA2B3X7R1H104M050BB
R243 = ERJ-2RKF33R0X: as R149 on sheet eth_10base-t1s_phy; ComponentLink1Description: Datasheet; ComponentLink1URL: https://industrial.panasonic.com/cdbs/www-data/pdf/RDA0000/AOA0000C304.pdf; Series: ERJ; Tolerance: ±1%; Composition: Thick Film; Features: Automotive AEC-Q200; Operating Temperature: -55°C ~ 155°C; Package / Case: 0402 (1005 Metric); Supplier Device Package: 0402; Size / Dimension: 0.039" L x 0.020" W (1.00mm x 0.50mm); Height - Seated (Max): 0.016" (0.40mm); Supplier 1: Digikey; Supplier Part Number 1: P33.0LCT-ND; Manufacturer Part Number: ERJ-2RKF33R0X
U9 = DHT_SENSOR_BME280: Pressure, Temperature and Humidity Sensor Digital Output 1.8V 8-Pin LGA T/R; Manufacturer: Bosch Tools; Supplier 1: Digikey; Supplier Part Number 1: 828-1063-1-ND; Manufacturer Part Number: BME280; ComponentLink1Description: Datasheet; ComponentLink1URL: https://www.bosch-sensortec.com/media/boschsensortec/downloads/datasheets/bst-bme280-ds002.pdf; Supplier 2: LCSC; Supplier Part Number 2: C92489